# Altium schematic sheet BI8.SchDoc
size 420 x 297 mm; DocumentNumber: 13; SheetNumber: 13; SheetTotal: 13; DecimalNumber: СНАБ.468222.001 ЭЗ
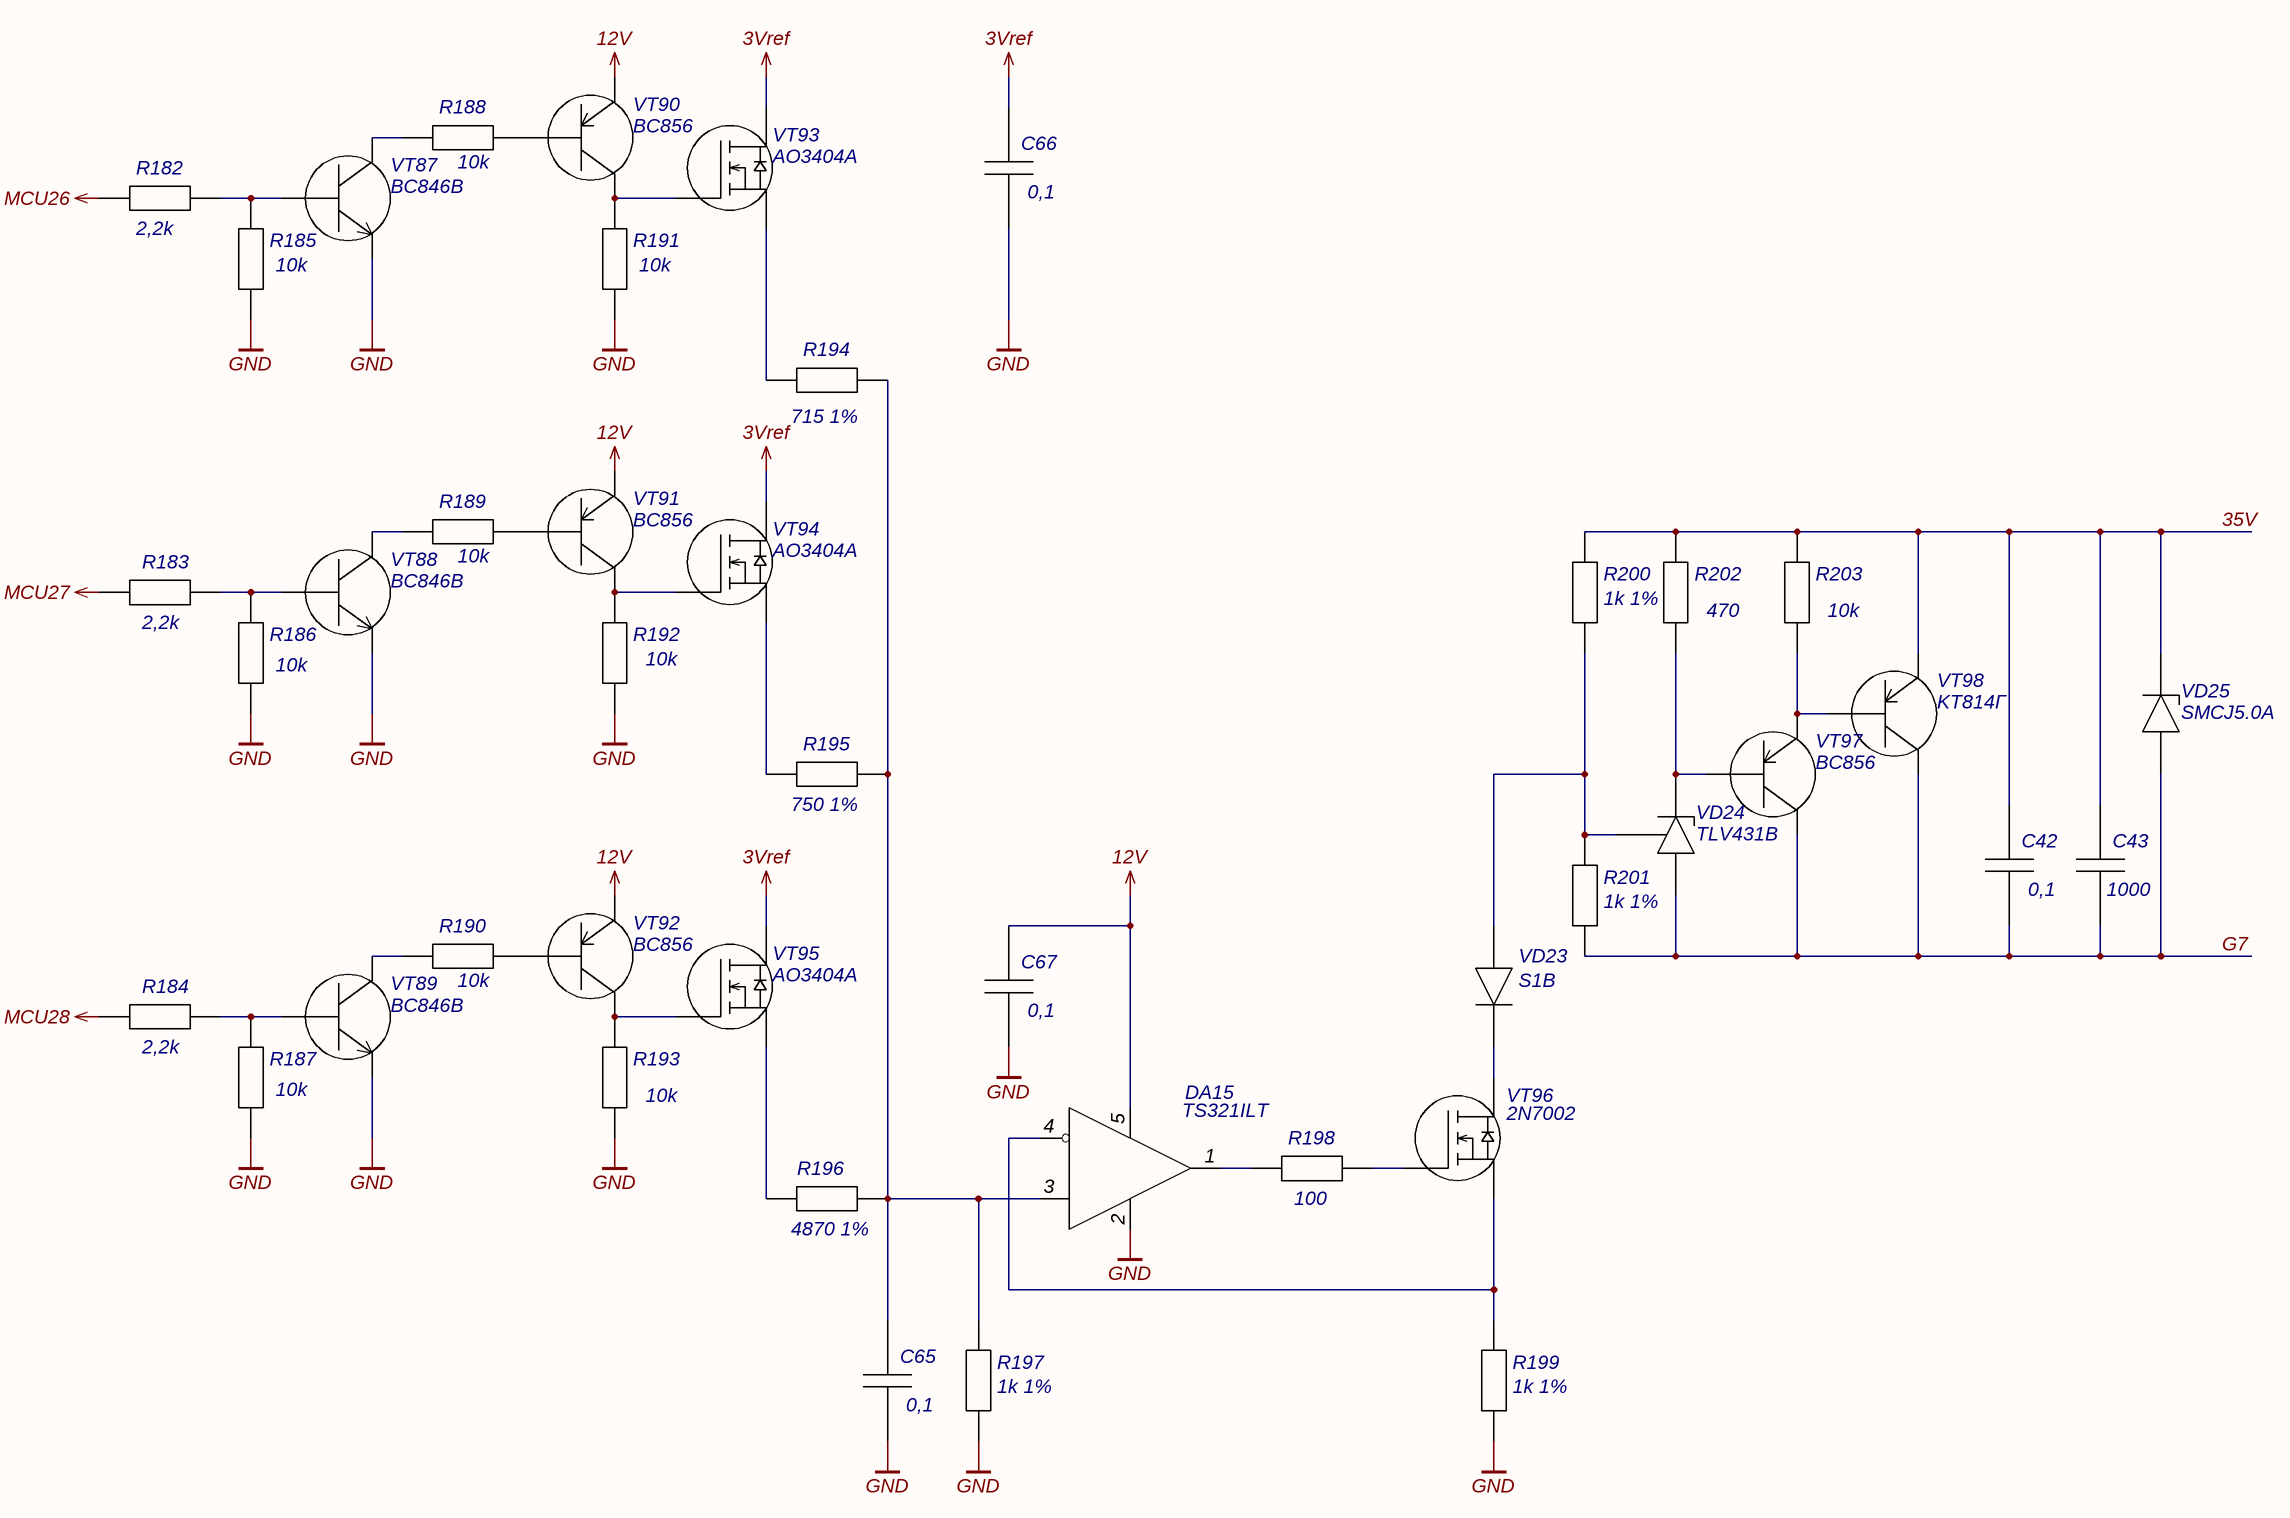
[diagram p0: BI8.SchDoc]

## Parts
C42  0,1  [C0603]
C43  1000  [C0603]
C65  0,1  [C0603]
C66  0,1  [C0603]
C67  0,1  [C0603]
DA15  TS321ILT  [SOT-23-5]
R182  2,2k  [R0603]
R183  2,2k  [R0603]
R184  2,2k  [R0603]
R185  10k  [R0603]
R186  10k  [R0603]
R187  10k  [R0603]
R188  10k  [R0603]
R189  10k  [R0603]
R190  10k  [R0603]
R191  10k  [R0603]
R192  10k  [R0603]
R193  10k  [R0603]
R194  715 1%  [R0603]
R195  750 1%  [R0603]
R196  4870 1%  [R0603]
R197  1k 1%  [R0603]
R198  100  [R0603]
R199  1k 1%  [R0603]
R200  1k 1%  [R0603]
R201  1k 1%  [R0603]
R202  470  [R0603]
R203  10k  [R0603]
VD23  S1B  [DO-214AC]
VD24  TLV431B  [SOT-23]
VD25  SMCJ5.0A  [DO-214AB]
VT87  BC846B  [SOT-23]
VT88  BC846B  [SOT-23]
VT89  BC846B  [SOT-23]
VT90  BC856  [SOT-23]
VT91  BC856  [SOT-23]
VT92  BC856  [SOT-23]
VT93  AO3404A  [SOT-23]
VT94  AO3404A  [SOT-23]
VT95  AO3404A  [SOT-23]
VT96  2N7002  [SOT-23]
VT97  BC856  [SOT-23]
VT98  KT814Г  [TO-126]

## Nets
3Vref: C66.2 VT93.2(D) VT94.2(D) VT95.2(D)
12V: C67.2 DA15.5(Vcc) VT90.1 VT91.1 VT92.1
GND: C65.1 C66.1 C67.1 DA15.2(GND) R185.1 R186.1 R187.1 R191.1 R192.1 R193.1 R197.1 R199.1 VT87.2(E) VT88.2(E) VT89.2(E)
MCU26: R182.1
MCU27: R183.1
MCU28: R184.1
35V: C42.2 C43.2 R200.2 R202.2 R203.2 VD25.2 VT98.1
G7: C42.1 C43.1 R201.1 VD24.1 VD25.1 VT97.2 VT98.2
NetC65_2: C65.2 DA15.3(+) R194.2 R195.2 R196.2 R197.2
NetDA15_1: DA15.1(OUT) R198.1
NetDA15_4: DA15.4(-) R199.2 VT96.3(S)
NetR182_2: R182.2 R185.2 VT87.1(B)
NetR183_2: R183.2 R186.2 VT88.1(B)
NetR184_2: R184.2 R187.2 VT89.1(B)
NetR188_1: R188.1 VT87.3(C)
NetR188_2: R188.2 VT90.3
NetR189_1: R189.1 VT88.3(C)
NetR189_2: R189.2 VT91.3
NetR190_1: R190.1 VT89.3(C)
NetR190_2: R190.2 VT92.3
NetR191_2: R191.2 VT90.2 VT93.1(G)
NetR192_2: R192.2 VT91.2 VT94.1(G)
NetR193_2: R193.2 VT92.2 VT95.1(G)
NetR194_1: R194.1 VT93.3(S)
NetR195_1: R195.1 VT94.3(S)
NetR196_1: R196.1 VT95.3(S)
NetR198_2: R198.2 VT96.1(G)
NetR200_1: R200.1 R201.2 VD23.1 VD24.3
NetR202_1: R202.1 VD24.2 VT97.3
NetR203_1: R203.1 VT97.1 VT98.3
NetVD23_2: VD23.2 VT96.2(D)

## Notes on the sheet
- Подп. и дата
- Инв.№ дубл.
- Взам.инв.№
- Подп.и дата
- Инв.№ подл.
- Изм.
- Лист
- № докум.
- Подп.
- Дата
- Копировал
- Формат  A3

## Library data of the parts
C42 C43 C65-C67 = Chip Capasitor: Чип-конденсатор
  C42 C65-C67: Value: 0,1
  C43: Value: 1000
DA15 = TS321ILT: 1х Операционный усилитель; Manufacurer: STMicroelectronics; Case: SOT-23-5; Name: TS321ILT; Datasheet: https://static.chipdip.ru/lib/710/DOC011710227.pdf
R182-R193 R198 R202 R203 = Chip Resistor: Чип-резистор
  R182-R184: Value: 2,2k
  R185-R193 R203: Value: 10k
  R198: Value: 100
  R202: Value: 470
R194 = Chip Resistor: Чип-резистор; Partnumber: RC0603FR-07715RL; Value: 715 1%; URL: https://www.chipdip.ru/product0/8002000768
R195 = Chip Resistor: Чип-резистор; Partnumber: RC0603FR-07750RL; Value: 750 1%; URL: https://www.chipdip.ru/product/0.1w-0603-750-om-1
R196 = Chip Resistor: Чип-резистор; Partnumber: RC0603FR-074K87L; Value: 4870 1%; URL: https://www.chipdip.ru/product0/8002000679
R197 R199-R201 = Chip Resistor: Чип-резистор; Partnumber: CRCW06031K00FKEAC; Value: 1k 1%; URL: https://www.chipdip.ru/product0/8002019285
VD23 = S1B: Диод выпрямительный, 100В; Manufacturer: Diotec Semiconductor; Case: DO-214AC; Name: S1B; Datasheet: https://static.chipdip.ru/lib/113/DOC032113174.pdf
VD24 = TLV431B: Стабилитрон регулируемый, 6В; Manufacturer: Texas Instruments; Case: SOT-23; Name: TLV431B; Datasheet: https://static.chipdip.ru/lib/985/DOC012985043.pdf
VD25 = SMCJ5.0A: Защитный диод, 5В; Manufacturer: UTD Semiconductor Co.,Ltd; Case: DO-201; Name: SMCJ5.0A; Datasheet: https://static.chipdip.ru/lib/863/DOC025863760.pdf
VT87-VT89 = BC846B: Транзистор биполярный NPN, 65В; Manufacturer: Nexperia B.V.; Case: SOT-23; Name: BC846B; Datasheet: https://static.chipdip.ru/lib/551/DOC012551042.pdf
VT90-VT92 VT97 = BC856: Транзистор биполярный PNP, 65В; Manufacturer: Nexperia; Case: SOT-23; Name: BC856; Datasheet: https://static.chipdip.ru/lib/365/DOC004365998.pdf
VT93-VT95 = AO3404A: Транзистор MOSFET N-канал, 30В; Manufacturer: UTD Semiconductor Co.,Ltd; Case: SOT-23; Name: AO3404A; Datasheet: https://static.chipdip.ru/lib/906/DOC012906979.pdf
VT96 = 2N7002: Транзистор MOSFET N-канал, 60В; Manufacturer: UTD Semiconductor Co.; Case: SOT-23; Name: 2N7002; Datasheet: https://static.chipdip.ru/lib/301/DOC021301072.pdf
VT98 = KT814Г: Транзистор биполярный PNP, 100В; Manufacturer: АО «ГРУППА КРЕМНИЙ ЭЛ»; TU: аАО.336.184 ТУ/02; Case: TO-126; Name: KT814Г; Datasheet: https://static.chipdip.ru/lib/404/DOC047404057.pdf